# Altium project Balance.PrjPcb
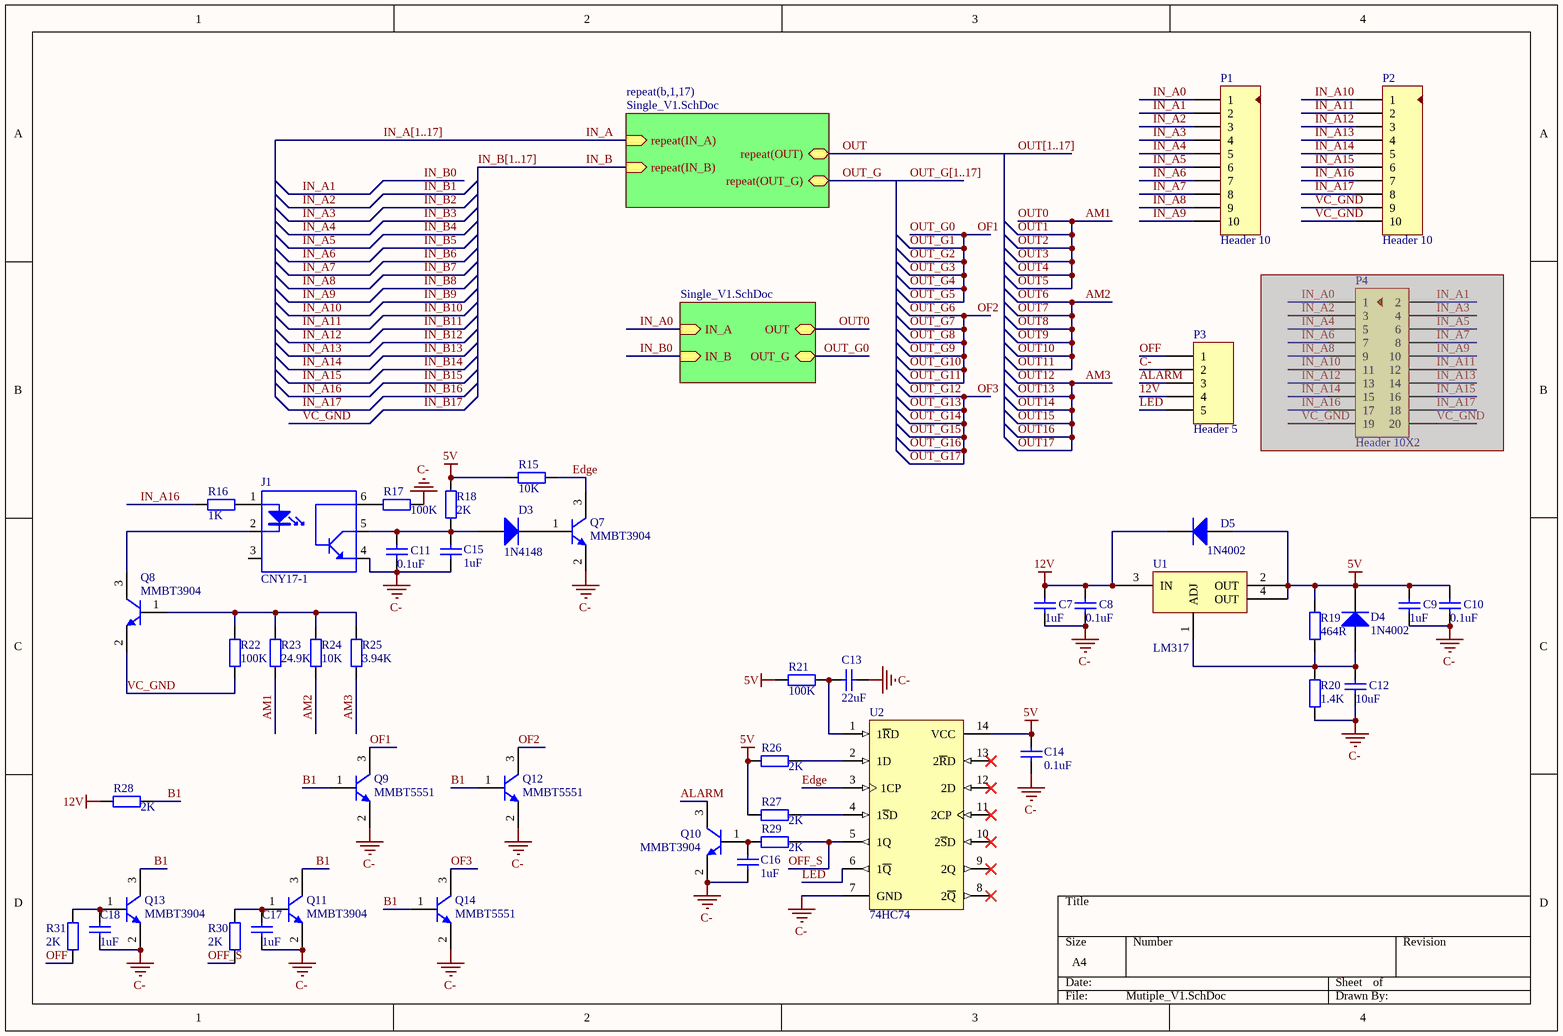
[diagram p0: Mutiple_V1.SchDoc]
2 sheets, 515 parts. Net scope: hierarchical (ports join the sheet entries above them; power ports are global).
Board files: top_INA2180.PcbDoc, top_LM358.PcbDoc, Mutiple.PcbDoc, Mutiple_V1.PcbDoc
Sheets:
  Mutiple_V1.SchDoc
    b1 = Single_V1.SchDoc
    b2 = Single_V1.SchDoc
    b3 = Single_V1.SchDoc
    b4 = Single_V1.SchDoc
    b5 = Single_V1.SchDoc
    b6 = Single_V1.SchDoc
    b7 = Single_V1.SchDoc
    b8 = Single_V1.SchDoc
    b9 = Single_V1.SchDoc
    b10 = Single_V1.SchDoc
    b11 = Single_V1.SchDoc
    b12 = Single_V1.SchDoc
    b13 = Single_V1.SchDoc
    b14 = Single_V1.SchDoc
    b15 = Single_V1.SchDoc
    b16 = Single_V1.SchDoc
    b17 = Single_V1.SchDoc
     = Single_V1.SchDoc

## Sheet Mutiple_V1.SchDoc
size A4

### Parts
C7  value 1uF  [C-0603]  (hidden comment: Cap-S)
C8  value 0.1uF  [C-0603]  (hidden comment: Cap-S)
C9  value 1uF  [C-0603]  (hidden comment: Cap-S)
C10  value 0.1uF  [C-0603]  (hidden comment: Cap-S)
C11  value 0.1uF  [C-0603]  (hidden comment: Cap-S)
C12  value 10uF  [C-0603]  (hidden comment: Cap-S)
C13  value 22uF  [C-0603]  (hidden comment: Cap-S)
C14  value 0.1uF  [C-0603]  (hidden comment: Cap-S)
C15  value 1uF  [C-0603]  (hidden comment: Cap-S)
C16  value 1uF  [C-0603]  (hidden comment: Cap-S)
C17  value 1uF  [C-0603]  (hidden comment: Cap-S)
C18  value 1uF  [C-0603]  (hidden comment: Cap-S)
D3  1N4148  [LED-0805]
D4  1N4002  [D-SMA]
D5  1N4002  [D-SMA]
J1  CNY17-1  [DIP-6]
P1  Header 10  [HDR10X1-2.54]
P2  Header 10  [HDR10X1-2.54]
P3  Header 5  [HDR1X5]
P4  Header 10X2  [HDR10X2-2.54]  (masked out: inside a compile mask, not in the netlist)
Q7  MMBT3904  [SOT23-3]
Q8  MMBT3904  [SOT23-3]
Q9  MMBT5551  [SOT23-3]
Q10  MMBT3904  [SOT23-3]
Q11  MMBT3904  [SOT23-3]
Q12  MMBT5551  [SOT23-3]
Q13  MMBT3904  [SOT23-3]
Q14  MMBT5551  [SOT23-3]
R15  value 10K  [0603-1]  (hidden comment: Res1)
R16  value 1K  [0603-1]  (hidden comment: Res1)
R17  value 100K  [0603-1]  (hidden comment: Res1)
R18  value 2K  [0603-1]  (hidden comment: Res1)
R19  value 464R  [0603-1]  (hidden comment: Res1)
R20  value 1.4K  [0603-1]  (hidden comment: Res1)
R21  value 100K  [0603-1]  (hidden comment: Res1)
R22  value 100K  [0603-1]  (hidden comment: Res1)
R23  value 24.9K  [0603-1]  (hidden comment: Res1)
R24  value 10K  [0603-1]  (hidden comment: Res1)
R25  value 3.94K  [0603-1]  (hidden comment: Res1)
R26  value 2K  [0603-1]  (hidden comment: Res1)
R27  value 2K  [0603-1]  (hidden comment: Res1)
R28  value 2K  [0603-1]  (hidden comment: Res1)
R29  value 2K  [0603-1]  (hidden comment: Res1)
R30  value 2K  [0603-1]  (hidden comment: Res1)
R31  value 2K  [0603-1]  (hidden comment: Res1)
U1  LM317  [SOT223]
U2  74HC74  [SOIC-14]

### Sub-sheets
repeat(b,1,17) = Single_V1.SchDoc: repeat(IN_A) (in), repeat(IN_B) (in), repeat(OUT) (bidir), repeat(OUT_G) (bidir)
? = Single_V1.SchDoc: IN_A (in), IN_B (in), OUT (bidir), OUT_G (bidir)

### Nets
5V: C9.2 C10.2 C14.1 D4.2(K) D5.1(A) R15.2 R18.2 R19.1 R21.2 R26.2 R27.2 U1.2(OUT) U1.4(OUT) U2.14(VCC)
12V: C7.2 C8.2 D5.2(K) P3.4 R28.1 U1.3(IN)
C-: C7.1 C8.1 C9.1 C10.1 C11.1 C12.1 C13.1 C14.2 C15.2 C16.2 C17.2 C18.2 J1.4(E) P3.2 Q7.2(E) Q9.2(E) Q10.2(E) Q11.2(E) Q12.2(E) Q13.2(E) Q14.2(E) R17.2 R20.2 U2.7(GND)
ALARM: P3.3 Q10.3(C)
AM1: R23.1 ; sheet /OUT  [also labelled OUT0, OUT1, OUT2, OUT3, OUT4, OUT5]  [project net AM]
AM2: R24.1  [also labelled OUT10, OUT11, OUT6, OUT7, OUT8, OUT9]  [project net AM]
AM3: R25.1  [also labelled OUT12, OUT13, OUT14, OUT15, OUT16, OUT17]  [project net AM]
B1: Q9.1(B) Q11.3(C) Q12.1(B) Q13.3(C) Q14.1(B) R28.2
Edge: Q7.3(C) R15.1 U2.3(1CP)
IN_A: sheet repeat(b,1,17)/repeat(IN_A)
IN_A0: P1.1 ; sheet /IN_A
IN_A1: P1.2 ; sheet /IN_B  [also labelled IN_B0]
IN_A2: P1.3  [also labelled IN_B1]
IN_A3: P1.4  [also labelled IN_B2]
IN_A4: P1.5  [also labelled IN_B3]
IN_A5: P1.6  [also labelled IN_B4]
IN_A6: P1.7  [also labelled IN_B5]
IN_A7: P1.8  [also labelled IN_B6]
IN_A8: P1.9  [also labelled IN_B7]
IN_A9: P1.10  [also labelled IN_B8]
IN_A10: P2.1  [also labelled IN_B9]
IN_A11: P2.2  [also labelled IN_B10]
IN_A12: P2.3  [also labelled IN_B11]
IN_A13: P2.4  [also labelled IN_B12]
IN_A14: P2.5  [also labelled IN_B13]
IN_A15: P2.6  [also labelled IN_B14]
IN_A16: P2.7 R16.1  [also labelled IN_B15]
IN_A17: P2.8  [also labelled IN_B16]
IN_B: sheet repeat(b,1,17)/repeat(IN_B)
IN_B17: P2.9 P2.10 Q8.2(E) R22.1  [also labelled VC_GND]
LED: P3.5 U2.6(1~{Q})
OF1: Q9.3(C) ; sheet /OUT_G  [also labelled OUT_G0, OUT_G1, OUT_G2, OUT_G3, OUT_G4, OUT_G5]  [project net OF]
OF2: Q12.3(C)  [also labelled OUT_G10, OUT_G11, OUT_G6, OUT_G7, OUT_G8, OUT_G9]  [project net OF]
OF3: Q14.3(C)  [also labelled OUT_G12, OUT_G13, OUT_G14, OUT_G15, OUT_G16, OUT_G17]  [project net OF]
OFF: P3.1 R31.1
OFF_S: R29.1 R30.1 U2.5(1Q)
OUT: sheet repeat(b,1,17)/repeat(OUT)
OUT_G: sheet repeat(b,1,17)/repeat(OUT_G)
NetC11_2: C11.2 C15.1 D3.1(A) J1.5(C) R18.1
NetC12_2: C12.2 D4.1(A) R19.2 R20.1 U1.1(ADJ)
NetC13_2: C13.2 R21.1 U2.1(1~{R}D)
NetC16_1: C16.1 Q10.1(B) R29.2
NetC17_1: C17.1 Q11.1(B) R30.2
NetC18_1: C18.1 Q13.1(B) R31.2
NetD3_2: D3.2(K) Q7.1(B)
NetJ1_1: J1.1(A) R16.2
NetJ1_2: J1.2(K) Q8.3(C)
NetJ1_6: J1.6(B) R17.1
NetQ8_1: Q8.1(B) R22.2 R23.2 R24.2 R25.2
NetR26_1: R26.1 U2.2(1D)
NetR27_1: R27.1 U2.4(1~{S}D)

Not connected (* = marked no-connect by the designer): J1 3(NC); U2 8(2~{Q})* 9(2Q)* 10(2~{S}D)* 11(2CP)* 12(2D)* 13(2~{R}D)*

### Buses and harness runs
bus IN_A[1..17]
bus IN_B[1..17]
bus OUT[1..17]
bus OUT_G[1..17]

### Library data of the parts
C7-C18 = Cap-S: 贴片瓷片电容; Published: 8-Jun-2000; LatestRevisionDate: 17-Jul-2002; LatestRevisionNote: Re-released for DXP Platform.; PackageReference: RAD-0.3; Publisher: Altium Limited
D3-D5 = Diode-R: 整流二极管; Published: 8-Jun-2000; LatestRevisionDate: 17-Jul-2002; LatestRevisionNote: Re-released for DXP Platform.; PackageDocument: Sep-1996; PackageReference: SMC; Publisher: Altium Limited
J1 = CNY17-1: 光电耦合器
P1 P2 = Header 10: 接插件; LatestRevisionDate: 17-Jul-2002; LatestRevisionNote: Re-released for DXP Platform.; Publisher: Altium Limited
P3 = Header 5: Header, 5-Pin; LatestRevisionDate: 17-Jul-2002; LatestRevisionNote: Re-released for DXP Platform.; Publisher: Altium Limited
P4 = Header 10X2: 接插件; LatestRevisionDate: 17-Jul-2002; LatestRevisionNote: Re-released for DXP Platform.; Publisher: Altium Limited
Q7-Q14 = NPN1: 贴片三极管; Published: 8-Jun-2000; LatestRevisionDate: 15-Jan-2003; LatestRevisionNote: PCB Footprint 'BCY-W3/D4.7' replaced; DatasheetDocument: 1997; PackageDocument: Sep-1998; PackageReference: TO-92A; Publisher: Altium Limited; Code_JEDEC: TO-92A; ComponentLink1Description: Manufacturer Link; ComponentLink1URL: http://www.fairchildsemi.com/; ComponentLink2Description: Datasheet; ComponentLink2URL: http://www.fairchildsemi.com/ds/2N%2F2N3904.pdf
R15-R31 = Res1: 贴片电阻; Published: 8-Jun-2000; LatestRevisionDate: 17-Jul-2002; LatestRevisionNote: Re-released for DXP Platform.; PackageReference: AXIAL-0.4; Publisher: Altium Limited
U1 = LM317: 稳压芯片
U2 = 74HC74: 单输入端双D触发器; Published: 17-Jul-2002; LatestRevisionDate: 13-Apr-2006; LatestRevisionNote: IPC-7351 Footprint Added.; DatasheetVersion: Nov-1999; PackageVersion: 2000; PackageReference: M16D; Publisher: Altium Limited; PackageDescription: 16-Pin Small Outline Package 1.27 mm Pitch; ComponentLink1Description: Manufacturer Link; ComponentLink1URL: http://www.fairchildsemi.com/; ComponentLink2Description: Datasheet; ComponentLink2URL: http://www.fairchildsemi.com/ds/74%2F74AC138.pdf

## Sheet Single_V1.SchDoc
size A4
Used 18 times, as channels b1, b2, b3, b4, b5, b6, b7, b8, b9, b10, b11, b12, b13, b14, b15, b16, b17, . Parts and nets are listed once, with the designators drawn on the sheet.
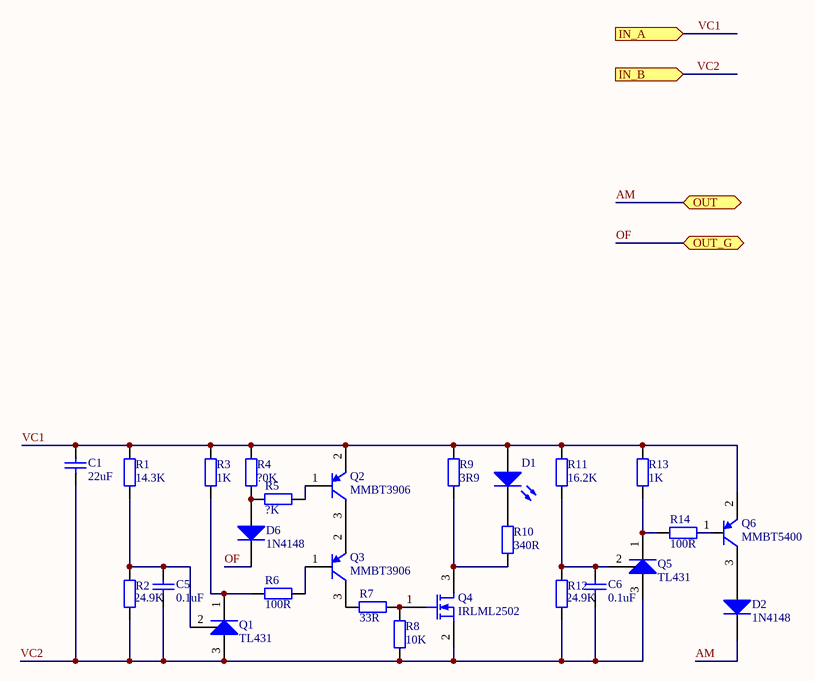
[diagram p1: Single_V1.SchDoc]

### Parts
C1  value 22uF  [C-0603]  (hidden comment: Cap-S)
C5  value 0.1uF  [C-0603]  (hidden comment: Cap-S)
C6  value 0.1uF  [C-0603]  (hidden comment: Cap-S)
D1  LED0  [LED-0805]  (value not drawn)
D2  1N4148  [LED-0805]
D6  1N4148  [LED-0805]
Q1  TL431  [SOT23-3]
Q2  MMBT3906  [SOT23-3]
Q3  MMBT3906  [SOT23-3]
Q4  IRLML2502  [SOT23-3]
Q5  TL431  [SOT23-3]
Q6  MMBT5400  [SOT23-3]
R1  value 14.3K  [0603-1]  (hidden comment: Res1)
R2  value 24.9K  [0603-1]  (hidden comment: Res1)
R3  value 1K  [0603-1]  (hidden comment: Res1)
R4  value ?0K  [0603-1]  (hidden comment: Res1)
R5  value ?K  [0603-1]  (hidden comment: Res1)
R6  value 100R  [0603-1]  (hidden comment: Res1)
R7  value 33R  [0603-1]  (hidden comment: Res1)
R8  value 10K  [0603-1]  (hidden comment: Res1)
R9  value 3R9  [AXIAL-1.0]  (hidden comment: Res1)
R10  value 340R  [0603-1]  (hidden comment: Res1)
R11  value 16.2K  [0603-1]  (hidden comment: Res1)
R12  value 24.9K  [0603-1]  (hidden comment: Res1)
R13  value 1K  [0603-1]  (hidden comment: Res1)
R14  value 100R  [0603-1]  (hidden comment: Res1)

### Ports
IN_A (in), IN_B (in), OUT (bidir), OUT_G (bidir)

### Nets
AM: D2.2(K) ; port OUT
OF: D6.2(K) ; port OUT_G
VC1: C1.2 D1.1(A) Q2.2(E) Q6.2(E) R1.2 R3.2 R4.1 R9.2 R11.2 R13.2 ; port IN_A
VC2: C1.1 C5.1 C6.1 Q1.3(A) Q4.2(S) Q5.3(A) R2.1 R8.1 R12.1 ; port IN_B
NetC5_2: C5.2 Q1.2(R) R1.1 R2.2
NetC6_2: C6.2 Q5.2(R) R11.1 R12.2
NetD1_2: D1.2(K) R10.2
NetD2_1: D2.1(A) Q6.3(C)
NetD6_1: D6.1(A) R4.2 R5.2
NetQ1_1: Q1.1(K) R3.1 R6.2
NetQ2_1: Q2.1(B) R5.1
NetQ2_3: Q2.3(C) Q3.2(E)
NetQ3_1: Q3.1(B) R6.1
NetQ3_3: Q3.3(C) R7.1
NetQ4_1: Q4.1(G) R7.2 R8.2
NetQ4_3: Q4.3(D) R9.1 R10.1
NetQ5_1: Q5.1(K) R13.1 R14.2
NetQ6_1: Q6.1(B) R14.1

### Channels
b1: designators end in _b1; ports IN_A=IN_A1 IN_B=IN_A2 OUT=AM OUT_G=OF
b2: designators end in _b2; ports IN_A=IN_A2 IN_B=IN_A3 OUT=AM OUT_G=OF
b3: designators end in _b3; ports IN_A=IN_A3 IN_B=IN_A4 OUT=AM OUT_G=OF
b4: designators end in _b4; ports IN_A=IN_A4 IN_B=IN_A5 OUT=AM OUT_G=OF
b5: designators end in _b5; ports IN_A=IN_A5 IN_B=IN_A6 OUT=AM OUT_G=OF
b6: designators end in _b6; ports IN_A=IN_A6 IN_B=IN_A7 OUT=AM OUT_G=OF
b7: designators end in _b7; ports IN_A=IN_A7 IN_B=IN_A8 OUT=AM OUT_G=OF
b8: designators end in _b8; ports IN_A=IN_A8 IN_B=IN_A9 OUT=AM OUT_G=OF
b9: designators end in _b9; ports IN_A=IN_A9 IN_B=IN_A10 OUT=AM OUT_G=OF
b10: designators end in _b10; ports IN_A=IN_A10 IN_B=IN_A11 OUT=AM OUT_G=OF
b11: designators end in _b11; ports IN_A=IN_A11 IN_B=IN_A12 OUT=AM OUT_G=OF
b12: designators end in _b12; ports IN_A=IN_A12 IN_B=IN_A13 OUT=AM OUT_G=OF
b13: designators end in _b13; ports IN_A=IN_A13 IN_B=IN_A14 OUT=AM OUT_G=OF
b14: designators end in _b14; ports IN_A=IN_A14 IN_B=IN_A15 OUT=AM OUT_G=OF
b15: designators end in _b15; ports IN_A=IN_A15 IN_B=IN_A16 OUT=AM OUT_G=OF
b16: designators end in _b16; ports IN_A=IN_A16 IN_B=IN_A17 OUT=AM OUT_G=OF
b17: designators end in _b17; ports IN_A=IN_A17 IN_B=IN_B17 OUT=AM OUT_G=OF
(top): designators end in _; ports IN_A=IN_A0 IN_B=IN_A1 OUT=AM OUT_G=OF

### Library data of the parts
C1 C5 C6 = Cap-S: 贴片瓷片电容; Published: 8-Jun-2000; LatestRevisionDate: 17-Jul-2002; LatestRevisionNote: Re-released for DXP Platform.; PackageReference: RAD-0.3; Publisher: Altium Limited
D1 = LED0: 发光二极管; Published: 8-Jun-2000; LatestRevisionDate: 08-Jul-2005; LatestRevisionNote: Mech Layer 1 removed.; PackageReference: LED-0; Publisher: Altium Limited
D2 D6 = Diode-R: 整流二极管; Published: 8-Jun-2000; LatestRevisionDate: 17-Jul-2002; LatestRevisionNote: Re-released for DXP Platform.; PackageDocument: Sep-1996; PackageReference: SMC; Publisher: Altium Limited
Q1 Q5 = TL431: 可控精密稳压源
Q2 Q3 Q6 = PNP1: 贴片三极管; Published: 8-Jun-2000; LatestRevisionDate: 15-Jan-2003; LatestRevisionNote: PCB Footprint 'BCY-W3/D4.7' replaced; DatasheetDocument: 1997; PackageDocument: Sep-1998; PackageReference: TO-92A; Publisher: Altium Limited; Code_JEDEC: TO-92A; ComponentLink1Description: Manufacturer Link; ComponentLink1URL: http://www.fairchildsemi.com/; ComponentLink2Description: Datasheet; ComponentLink2URL: http://www.fairchildsemi.com/ds/2N%2F2N3906.pdf
Q4 = MOSFET-N1: MOSFET; Published: 8-Jun-2000; LatestRevisionDate: 17-Jul-2002; LatestRevisionNote: Re-released for DXP Platform.; PackageVersion: 1995/1996; PackageReference: E3; Publisher: Altium Limited
R1-R14 = Res1: 贴片电阻; Published: 8-Jun-2000; LatestRevisionDate: 17-Jul-2002; LatestRevisionNote: Re-released for DXP Platform.; PackageReference: AXIAL-0.4; Publisher: Altium Limited

## Nets that join several sheets
AM: Mutiple_V1 (R23.1), b1 (D2_b1.2), b2 (D2_b2.2), b3 (D2_b3.2), b4 (D2_b4.2), b5 (D2_b5.2),  (D2_.2)
AM: Mutiple_V1 (R24.1), b6 (D2_b6.2), b7 (D2_b7.2), b8 (D2_b8.2), b9 (D2_b9.2), b10 (D2_b10.2), b11 (D2_b11.2)
AM: Mutiple_V1 (R25.1), b12 (D2_b12.2), b13 (D2_b13.2), b14 (D2_b14.2), b15 (D2_b15.2), b16 (D2_b16.2), b17 (D2_b17.2)
IN_A0: Mutiple_V1 (P1.1),  (10 pins)
IN_A1: Mutiple_V1 (P1.2), b1 (10 pins),  (9 pins)
IN_A2: Mutiple_V1 (P1.3), b1 (9 pins), b2 (10 pins)
IN_A3: Mutiple_V1 (P1.4), b2 (9 pins), b3 (10 pins)
IN_A4: Mutiple_V1 (P1.5), b3 (9 pins), b4 (10 pins)
IN_A5: Mutiple_V1 (P1.6), b4 (9 pins), b5 (10 pins)
IN_A6: Mutiple_V1 (P1.7), b5 (9 pins), b6 (10 pins)
IN_A7: Mutiple_V1 (P1.8), b6 (9 pins), b7 (10 pins)
IN_A8: Mutiple_V1 (P1.9), b7 (9 pins), b8 (10 pins)
IN_A9: Mutiple_V1 (P1.10), b8 (9 pins), b9 (10 pins)
IN_A10: Mutiple_V1 (P2.1), b9 (9 pins), b10 (10 pins)
IN_A11: Mutiple_V1 (P2.2), b10 (9 pins), b11 (10 pins)
IN_A12: Mutiple_V1 (P2.3), b11 (9 pins), b12 (10 pins)
IN_A13: Mutiple_V1 (P2.4), b12 (9 pins), b13 (10 pins)
IN_A14: Mutiple_V1 (P2.5), b13 (9 pins), b14 (10 pins)
IN_A15: Mutiple_V1 (P2.6), b14 (9 pins), b15 (10 pins)
IN_A16: Mutiple_V1 (P2.7 R16.1), b15 (9 pins), b16 (10 pins)
IN_A17: Mutiple_V1 (P2.8), b16 (9 pins), b17 (10 pins)
IN_B17: Mutiple_V1 (P2.9 P2.10 Q8.2 R22.1), b17 (9 pins)
OF: Mutiple_V1 (Q9.3), b1 (D6_b1.2), b2 (D6_b2.2), b3 (D6_b3.2), b4 (D6_b4.2), b5 (D6_b5.2),  (D6_.2)
OF: Mutiple_V1 (Q12.3), b6 (D6_b6.2), b7 (D6_b7.2), b8 (D6_b8.2), b9 (D6_b9.2), b10 (D6_b10.2), b11 (D6_b11.2)
OF: Mutiple_V1 (Q14.3), b12 (D6_b12.2), b13 (D6_b13.2), b14 (D6_b14.2), b15 (D6_b15.2), b16 (D6_b16.2), b17 (D6_b17.2)